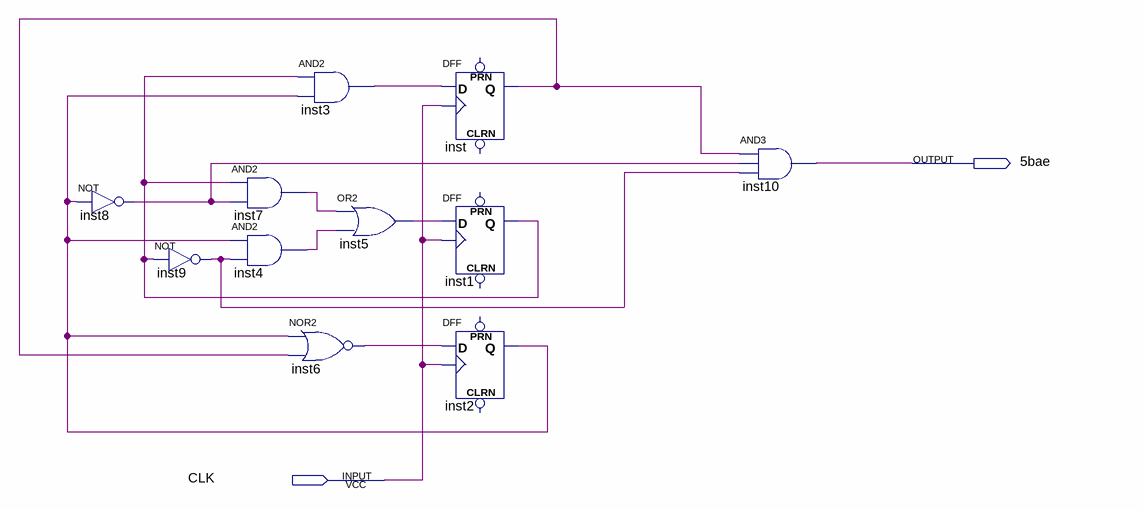
[diagram p0: schematic sheet]
// Quartus schematic 5HZ.bdf as structural Verilog: 11 symbols, 2 pins
module \5HZ  (
  input  CLK,
  output \5bae 
);

  wire inst1_q, inst2_q, inst3_out, inst4_out, inst5_out, inst6_out, inst7_out, inst8_out, inst9_out, inst_q;

  not inst8 (inst8_out, inst2_q);
  not inst9 (inst9_out, inst1_q);
  and inst7 (inst7_out, inst1_q, inst8_out);
  and inst4 (inst4_out, inst2_q, inst9_out);
  and inst3 (inst3_out, inst1_q, inst2_q);
  or inst5 (inst5_out, inst7_out, inst4_out);
  nor inst6 (inst6_out, inst2_q, inst_q);
  DFF inst (.CLK(CLK), .D(inst3_out), .Q(inst_q));  // open: CLRN, PRN
  DFF inst1 (.CLK(CLK), .D(inst5_out), .Q(inst1_q));  // open: CLRN, PRN
  DFF inst2 (.CLK(CLK), .D(inst6_out), .Q(inst2_q));  // open: CLRN, PRN
  and inst10 (\5bae , inst_q, inst8_out, inst9_out);
endmodule
